# Altium schematic sheet ПР1803Н.SchDoc
size 410 x 297 mm; SheetNumber: 1; SheetTotal: 3
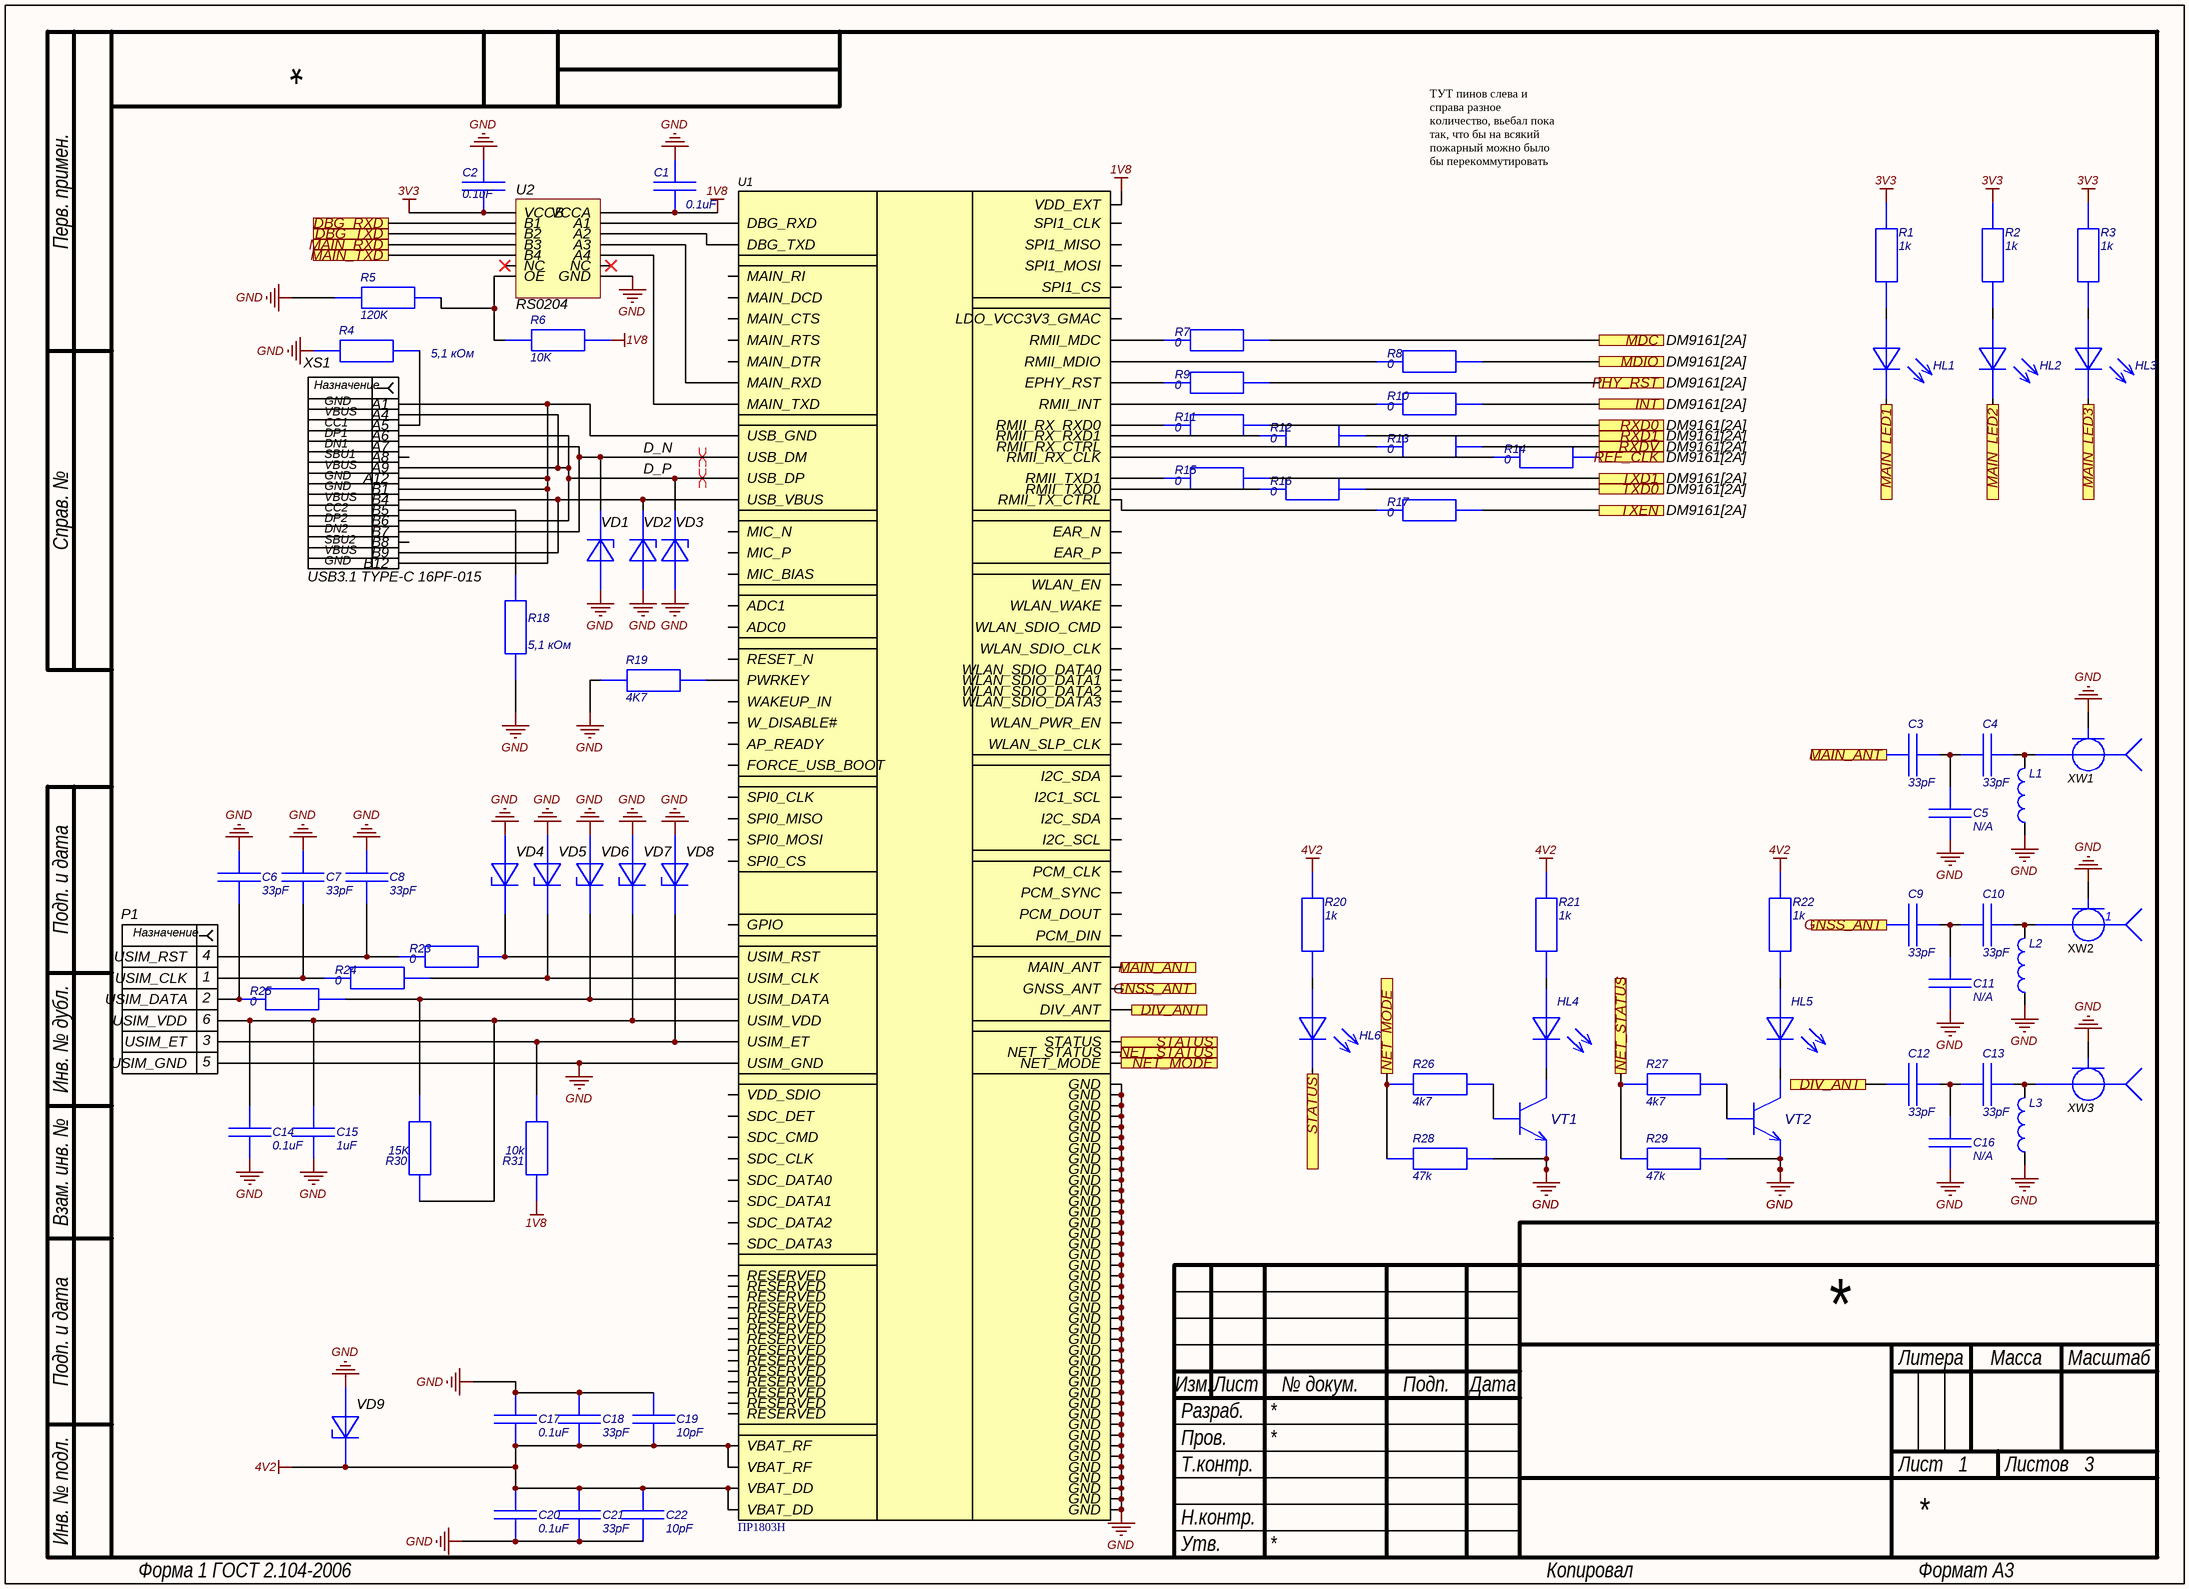
[diagram p0: ПР1803Н.SchDoc]

## Parts
C1  0.1uF  [C0603]
C2  0.1uF  [C0603]
C3  33pF  [C0603]
C4  33pF  [C0603]
C5  N/A  [C0603]
C6  33pF  [C0603]
C7  33pF  [C0603]
C8  33pF  [C0603]
C9  33pF  [C0603]
C10  33pF  [C0603]
C11  N/A  [C0603]
C12  33pF  [C0603]
C13  33pF  [C0603]
C14  0.1uF  [C0603]
C15  1uF  [C0603]
C16  N/A  [C0603]
C17  0.1uF  [C0603]
C18  33pF  [C0603]
C19  10pF  [C0603]
C20  0.1uF  [C0603]
C21  33pF  [C0603]
C22  10pF  [C0603]
HL1  Text  [LD0603]  (value not drawn)
HL2  Text  [LD0603]  (value not drawn)
HL3  Text  [LD0603]  (value not drawn)
HL4  Text  [LD0603]  (value not drawn)
HL5  Text  [LD0603]  (value not drawn)
HL6  Text  [LD0603]  (value not drawn)
L1  Inductor  [L0402]  (value not drawn)
L2  Inductor  [L0402]  (value not drawn)
L3  Inductor  [L0402]  (value not drawn)
P1  KF034  [RUICHI KF034]  (value not drawn)
R1  1k  [R0603]
R2  1k  [R0603]
R3  1k  [R0603]
R4  5,1 кОм  [R0603]
R5  120K  [R0603]
R6  10K  [R0603]
R7  0  [R0603]
R8  0  [R0603]
R9  0  [R0603]
R10  0  [R0603]
R11  0  [R0603]
R12  0  [R0603]
R13  0  [R0603]
R14  0  [R0603]
R15  0  [R0603]
R16  0  [R0603]
R17  0  [R0603]
R18  5,1 кОм  [R0603]
R19  4K7  [R0603]
R20  1k  [R0603]
R21  1k  [R0603]
R22  1k  [R0603]
R23  0  [R0603]
R24  0  [R0603]
R25  0  [R0603]
R26  4k7  [R0603]
R27  4k7  [R0603]
R28  47k  [R0603]
R29  47k  [R0603]
R30  15K  [R0603]
R31  10k  [R0603]
U1  ПР1803Н  [LCCS130P2900X3200X254-80L]
U2  RS0204  [SOP65P640X120-14N]
VD1  Zener  [DIO_BZT52C3V9S]  (value not drawn)
VD2  Zener  [DIO_BZT52C3V9S]  (value not drawn)
VD3  Zener  [DIO_BZT52C3V9S]  (value not drawn)
VD4  Zener  [DIO_BZT52C3V9S]  (value not drawn)
VD5  Zener  [DIO_BZT52C3V9S]  (value not drawn)
VD6  Zener  [DIO_BZT52C3V9S]  (value not drawn)
VD7  Zener  [DIO_BZT52C3V9S]  (value not drawn)
VD8  Zener  [DIO_BZT52C3V9S]  (value not drawn)
VD9  Zener  [DIO_BZT52C3V9S]  (value not drawn)
VT1  BJT-NPN  [TRANS_BC847C]  (value not drawn)
VT2  BJT-NPN  [TRANS_BC847C]  (value not drawn)
XS1  USB3.1 TYPE-C 16PF-015  [HRO_TYPE-C-31-M-12]
XW1  Con-RF-F  [LINX_CONUFL001-SMD-T]  (value not drawn)
XW2  Con-RF-F  [LINX_CONUFL001-SMD-T]  (value not drawn)
XW3  Con-RF-F  [LINX_CONUFL001-SMD-T]  (value not drawn)

## Ports
DBG_RXD (see Коннекторы[2A], Коннекторы[3A]), DBG_TXD (see Коннекторы[2A], Коннекторы[3A]), DIV_ANT (see ПР1803Н[3B]), DIV_ANT (see ПР1803Н[4B]), GNSS_ANT (see ПР1803Н[3B]), GNSS_ANT (see ПР1803Н[4B]), INT (see DM9161[2A]), MAIN_ANT (see ПР1803Н[3B]), MAIN_ANT (see ПР1803Н[4A]), MAIN_LED1 (see Коннекторы[2B], Коннекторы[3B]), MAIN_LED2 (see Коннекторы[2B], Коннекторы[3B]), MAIN_LED3 (see Коннекторы[2A], Коннекторы[3A]), MAIN_RXD (see Коннекторы[2A], Коннекторы[3A]), MAIN_TXD (see Коннекторы[2A], Коннекторы[3A]), MDC (see DM9161[2A]), MDIO (see DM9161[2A]), NET_MODE (see ПР1803Н[3B]), NET_STATUS (see ПР1803Н[3B]), PHY_RST (see DM9161[2A]), REF_CLK (see DM9161[2A]), RXD0 (see DM9161[2A]), RXD1 (see DM9161[2A]), RXDV (see DM9161[2A]), STATUS (see ПР1803Н[3B]), TXD0 (see DM9161[2A]), TXD1 (see DM9161[2A]), TXEN (see DM9161[2A])

## Nets
1V8: C1.2 R6.2 R31.1 U1.7(VDD_EXT) U2.1(VCCA)
3V3: C2.2 R1.2 R2.2 R3.2 U2.14(VCCB)
4V2: C17.1 C18.1 C19.1 C20.2 C21.2 C22.2 R20.2 R21.2 R22.2 U1.57(VBAT_RF) U1.58(VBAT_RF) U1.59(VBAT_DD) U1.60(VBAT_DD) VD9.2(К)
GND: C1.1 C2.1 C5.1 C6.1 C7.1 C8.1 C11.1 C14.1 C15.1 C16.1 C17.2 C18.2 C19.2 C20.1 C21.1 C22.1 L1.1 L2.1 L3.1 P1.5(USIM_GND) R4.1 R5.1 R18.1 R19.2 R28.2 R29.2 U1.8(GND) U1.9(GND) U1.10(USIM_GND) U1.19(GND) U1.22(GND) U1.36(GND) U1.46(GND) U1.48(GND) U1.50(GND) U1.51(GND) U1.52(GND) U1.53(GND) U1.54(GND) U1.56(GND) U1.85(GND) U1.86(GND) U1.87(GND) U1.88(GND) U1.89(GND) U1.90(GND) U1.91(GND) U1.92(GND) U1.93(GND) U1.94(GND) U1.95(GND) U1.96(GND) U1.97(GND) U1.98(GND) U1.99(GND) U1.100(GND) U1.101(GND) U1.102(GND) U1.103(GND) U1.104(GND) U1.105(GND) U1.106(GND) U1.107(GND) U1.108(GND) U1.109(GND) U1.110(GND) U1.111(GND) U1.112(GND) U2.7(GND) VD1.1(А) VD2.1(А) VD3.1(А) VD4.1(А) VD5.1(А) VD6.1(А) VD7.1(А) VD8.1(А) VD9.1(А) VT1.3(Э) VT2.3(Э) XW1.2 XW2.2 XW3.2
D_N: U1.70(USB_DM) VD1.2(К) XS1.A7 XS1.B7
D_P: U1.69(USB_DP) VD3.2(К) XS1.A4_B9(A4) XS1.A6 XS1.B4_A9(A9) XS1.B6
DBG_RXD: U2.13(B1) ; port DBG_RXD
DBG_TXD: U2.12(B2) ; port DBG_TXD
DIV_ANT: C12.2 U1.35(DIV_ANT) ; port DIV_ANT
GNSS_ANT: C9.2 U1.47(GNSS_ANT) ; port GNSS_ANT
INT: R10.1 ; port INT
MAIN_ANT: C3.2 U1.49(MAIN_ANT) ; port MAIN_ANT
MAIN_LED1: HL1.2(К) ; port MAIN_LED1
MAIN_LED2: HL2.2(К) ; port MAIN_LED2
MAIN_LED3: HL3.2(К) ; port MAIN_LED3
MAIN_RXD: U2.11(B3) ; port MAIN_RXD
MAIN_TXD: U2.10(B4) ; port MAIN_TXD
MDC: R7.1 ; port MDC
MDIO: R8.1 ; port MDIO
NET_MODE: R26.1 R28.1 U1.5(NET_MODE) ; port NET_MODE
NET_STATUS: R27.1 R29.1 U1.6(NET_STATUS) ; port NET_STATUS
PHY_RST: R9.1 ; port PHY_RST
REF_CLK: R14.1 ; port REF_CLK
RXD0: R11.1 ; port RXD0
RXD1: R12.1 ; port RXD1
RXDV: R13.1 ; port RXDV
STATUS: HL6.2(К) U1.61(STATUS) ; port STATUS
TXD0: R16.1 ; port TXD0
TXD1: R15.1 ; port TXD1
TXEN: R17.1 ; port TXEN
NetC3_1: C3.1 C4.2 C5.2
NetC4_1: C4.1 L1.2 XW1.1
NetC6_2: C6.2 P1.2(USIM_DATA) R25.2
NetC7_2: C7.2 P1.1(USIM_CLK) R24.2
NetC8_2: C8.2 P1.4(USIM_RST) R23.2
NetC9_1: C9.1 C10.2 C11.2
NetC10_1: C10.1 L2.2 XW2.1
NetC12_1: C12.1 C13.2 C16.2
NetC13_1: C13.1 L3.2 XW3.1
NetC14_2: C14.2 C15.2 P1.6(USIM_VDD) R30.1 U1.14(USIM_VDD) VD7.2(К)
NetHL1_1: HL1.1(А) R1.1
NetHL2_1: HL2.1(А) R2.1
NetHL3_1: HL3.1(А) R3.1
NetHL4_1: HL4.1(А) R21.1
NetHL4_2: HL4.2(К) VT1.2(К)
NetHL5_1: HL5.1(А) R22.1
NetHL5_2: HL5.2(К) VT2.2(К)
NetHL6_1: HL6.1(А) R20.1
NetP1_3: P1.3(USIM_ET) R31.2 U1.13(USIM_ET) VD8.2(К)
NetR4_2: R4.2 XS1.A5
NetR5_2: R5.2 R6.1 U2.8(OE)
NetR7_2: R7.2 U1.122(RMII_MDC)
NetR8_2: R8.2 U1.121(RMII_MDIO)
NetR9_2: R9.2 U1.119(EPHY_RST)
NetR10_2: R10.2 U1.120(RMII_INT)
NetR11_2: R11.2 U1.84(EAR_P)
NetR12_2: R12.2 U1.83(EAR_N)
NetR13_2: R13.2 U1.80(RMII_RX_CTRL)
NetR14_2: R14.2 U1.79(RMII_RX_CLK)
NetR15_2: R15.2 U1.76(RMII_TXD1)
NetR16_2: R16.2 U1.75(RMII_TXD0)
NetR17_2: R17.2 U1.73(RMII_TX_CTRL)
NetR18_2: R18.2 XS1.B5
NetR19_1: R19.1 U1.21(PWRKEY)
NetR23_1: R23.1 U1.17(USIM_RST) VD4.2(К)
NetR24_1: R24.1 U1.16(USIM_CLK) VD5.2(К)
NetR25_1: R25.1 R30.2 U1.15(USIM_DATA) VD6.2(К)
NetR26_2: R26.2 VT1.1(Б)
NetR27_2: R27.2 VT2.1(Б)
NetU1_11: U1.11(DBG_TXD) U2.3(A2)
NetU1_12: U1.12(DBG_RXD) U2.2(A1)
NetU1_67: U1.67(MAIN_RXD) U2.4(A3)
NetU1_68: U1.68(MAIN_TXD) U2.5(A4)
NetU1_71: U1.71(USB_VBUS) VD2.2(К) XS1.A4_B9(B9) XS1.B4_A9(B4)
NetU1_72: U1.72(USB_GND) XS1.A1_B12(A1) XS1.B1_A12(A12)

Not connected (* = marked no-connect by the designer): U1 1(WAKEUP_IN) 2(AP_READY) 3(RESERVED) 4(W_DISABLE#) 18(RESERVED) 20(RESET_N) 23(SDC_DET) 24(PCM_DIN) 25(PCM_DOUT) 26(PCM_SYNC) 27(PCM_CLK) 28(SDC_DATA3) 29(SDC_DATA2) 30(SDC_DATA1) 31(SDC_DATA0) 32(SDC_CLK) 33(SDC_CMD) 34(VDD_SDIO) 37(SPI0_CS) 38(SPI0_MOSI) 39(SPI0_MISO) 40(SPI0_CLK) 41(I2C_SCL) 42(I2C_SDA) 43(RESERVED) 44(ADC1) 45(ADC0) 55(RESERVED) 62(MAIN_RI) 63(MAIN_DCD) 64(MAIN_CTS) 65(MAIN_RTS) 66(MAIN_DTR) 74(RESERVED) 77(SPI1_MISO) 78(SPI1_MOSI) 81(SPI1_CLK) 82(SPI1_CS) 113(RESERVED) 114(RESERVED) 115(FORCE_USB_BOOT) 116(RESERVED) 117(RESERVED) 118(WLAN_SLP_CLK) 125(MIC_P) 126(MIC_N) 127(WLAN_PWR_EN) 128(LDO_VCC3V3_GMAC) 129(WLAN_SDIO_DATA3) 130(WLAN_SDIO_DATA2) 131(WLAN_SDIO_DATA1) 132(WLAN_SDIO_DATA0) 133(WLAN_SDIO_CLK) 134(WLAN_SDIO_CMD) 135(WLAN_WAKE) 136(WLAN_EN) 137(RESERVED) 138(RESERVED) 139(GPIO) 140(MIC_BIAS) 141(RESERVED) 142(RESERVED) 143(I2C1_SCL) 144(I2C_SDA); U2 6(NC)* 9(NC)*; XS1 A8 B8

## Layout directives
differential pair: D_N, D_P

## Notes on the sheet
- ТУТ пинов слева и справа разное количество, вьебал пока так, что бы на всякий пожарный можно было бы перекоммутировать
- Перв. примен.
- Справ. №
- Подп. и дата
- Инв. № дубл.
- Взам. инв. №
- Разраб.
- Изм.
- Лист
- № докум.
- Подп.
- Дата
- Литера
- Масса
- Масштаб
- Пров.
- Т.контр.
- Листов
- Инв. № подл.
- Н.контр.
- Утв.
- Форма 1 ГОСТ 2.104-2006
- Копировал
- Формат А3
- (in symbol KF034) Назначение
- (in symbol USB3.1 TYPE-C 16PF-015) Назначение; GND; VBUS; CC1; DP1; DN1; SBU1; CC2; DP2; DN2; SBU2

## Library data of the parts
C1-C22 = Capacitor: Type: Конденсатор; Published: 18.05.2010; Publisher: Andrew Danich
HL1-HL6 = Led-1: Type: Индикатор единичный; Published: 03.12.2013; Publisher: Andrew Danich
L1-L3 = Inductor: Code_IEC: 1005; Value: 68nH; Published: 8-Jun-2000; LatestRevisionDate: 29-May-2009; LatestRevisionNote: IPC-7351 Footprint Added.; PackageReference: 0402-A; Publisher: Altium Limited; PackageDescription: Chip Inductor; Code_JEITA: 0402
R1-R31 = Resistor: Published: 24.03.2010; Publisher: Andrew Danich; Type: Резистор
VD1-VD9 = Zener: pin to pad: 1>A 2>C; Type: Стабилитрон; Published: 20.05.2013; Publisher: Andrew Danich
VT1 VT2 = BJT-NPN: Type: Транзистор; Published: 07.05.2013; Publisher: Andrew Danich
XW1-XW3 = Con-RF-F: Published: 19.09.2015; Publisher: НТЦ "Вектор"; Type: Розетка